# Altium schematic sheet [12] MISC.SchDoc: MISC
size A4; Engineer: M. Folejewski; DocumentNumber: 12; SheetNumber: 12; SheetTotal: 15; PageSize: A4; Designators: 800-899
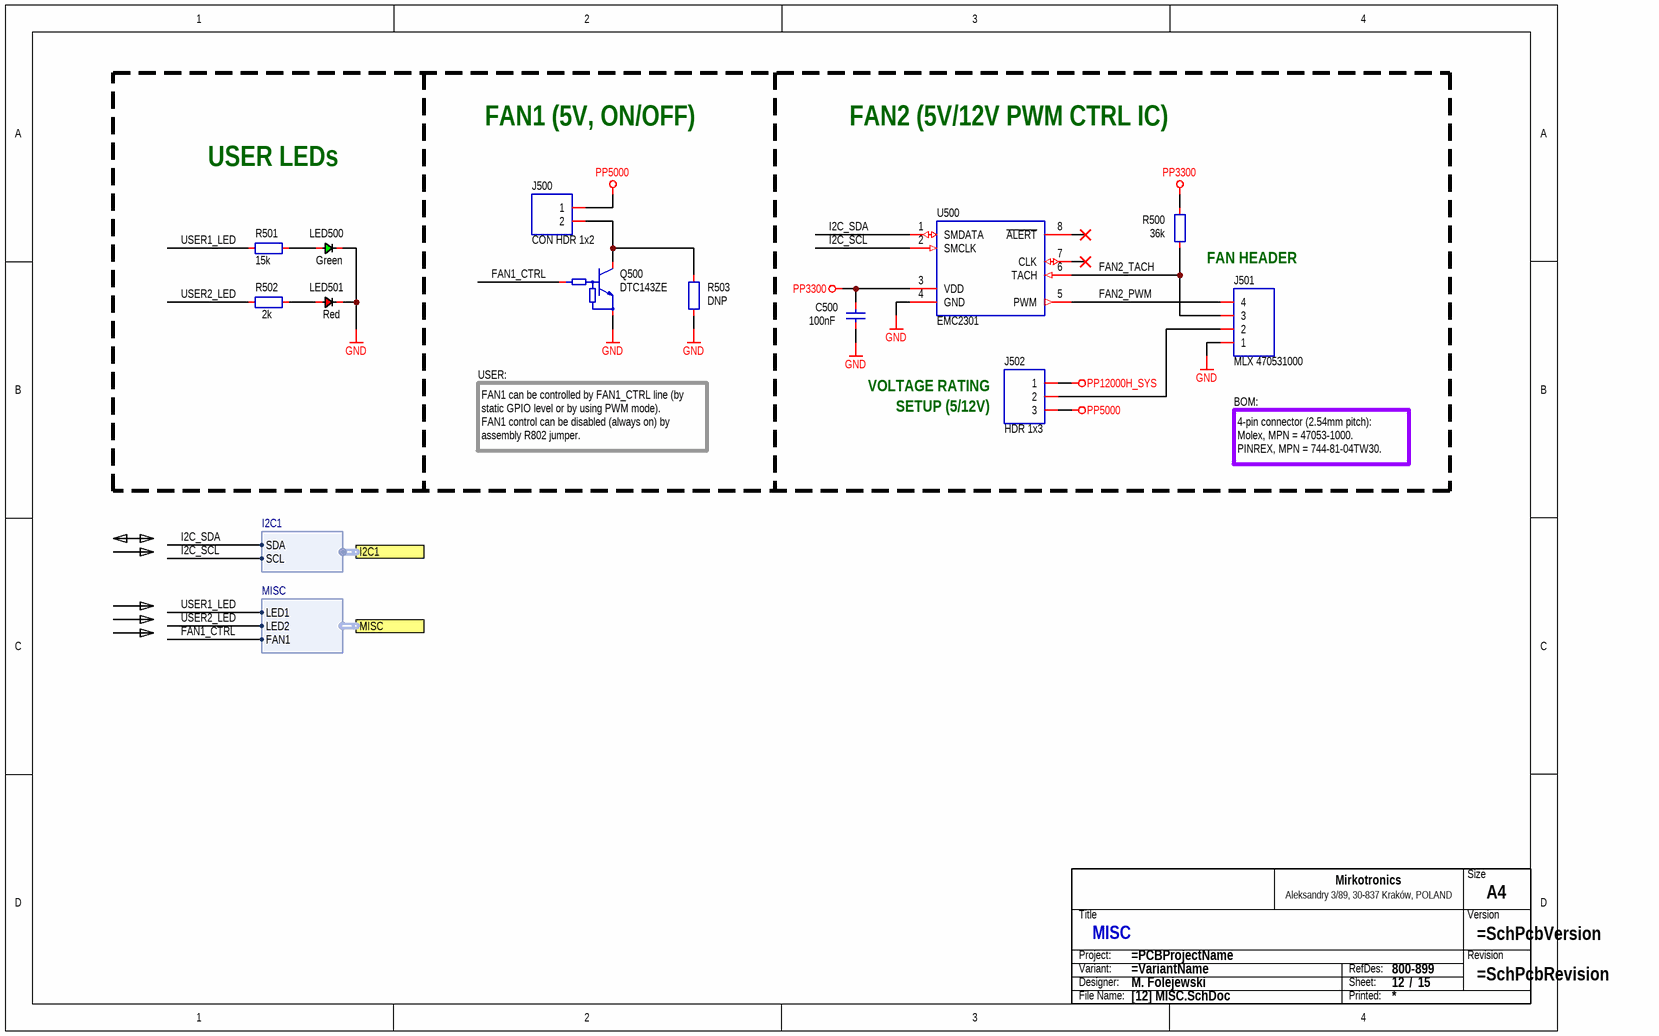
[diagram p0: [12] MISC.SchDoc]

## Parts
C500  100nF  [CAP_0603_R]
J500  CON HDR 1x2  [CON_HDR_P254_1X02_STR]
J501  MLX 470531000  [CON_MLX_470531000]
J502  HDR 1x3  [CON_HDR_P254_1X03_STR_JMP]
LED500  Green  [LED_0805_GRN_R]
LED501  Red  [LED_0805_RED_R]
Q500  DTC143ZE  [PKG_SOT523_SC75_SOT416_P100_R]
R500  36k  [RES_0603_R]
R501  15k  [RES_0603_R]
R502  2k  [RES_0603_R]
R503  DNP  [RES_0603_R]
TB?  Title block  (value not drawn)  (graphical)
U500  EMC2301  [ICC_TSSOP8_300X300X110P65]

## Ports
I2C1 (harness I2C1), MISC (harness MISC)

## Harnesses
MISC: LED1, LED2, FAN1
I2C1: SDA, SCL

## Nets
GND: C500.1 J501.1 LED500.1 LED501.1 Q500.2(E) R503.1 U500.4(GND)
PP3300: C500.2 R500.2 U500.3(VDD)
PP5000: J500.1 J502.3
PP12000H_SYS: J502.1
FAN1_CTRL: Q500.1(B) ; port MISC.FAN1
FAN2_PWM: J501.4 U500.5(PWM)
FAN2_TACH: J501.3 R500.1 U500.6(TACH)
I2C_SCL: U500.2(SMCLK) ; port I2C1.SCL
I2C_SDA: U500.1(SMDATA) ; port I2C1.SDA
USER1_LED: R501.1 ; port MISC.LED1
USER2_LED: R502.1 ; port MISC.LED2
NetJ500_2: J500.2 Q500.3(C) R503.2
NetJ501_2: J501.2 J502.2
NetLED500_2: LED500.2 R501.2
NetLED501_2: LED501.2 R502.2

Not connected (* = marked no-connect by the designer): U500 7(CLK)* 8(~{ALERT})*

## Notes on the sheet
- USER LEDs
- FAN1 (5V, ON/OFF)
- FAN2 (5V/12V PWM CTRL IC)
- FAN HEADER
- USER:
- FAN1 can be controlled by FAN1_CTRL line (by static GPIO level or by using PWM mode).
  FAN1 control can be disabled (always on) by assembly R802 jumper.
- VOLTAGE RATING
- SETUP (5/12V)
- BOM:
- 4-pin connector (2.54mm pitch):
  Molex, MPN = 47053-1000.
  PINREX, MPN = 744-81-04TW30.
- (in symbol SCH_TITLE_BLOCK_MIRKOTRONICS_V2) Size; Mirkotronics; Aleksandry 3/89, 30-837 Kraków, POLAND; Title; Version; Project:; Revision; Variant:; RefDes:; Designer:; Sheet:; /; File Name:; Printed:

## Library data of the parts
C500 = CAP-0008: Capacitor; MLCC; 100nF; TBD; TBD; TBD; TBD; SMD; 0603 (1608);; Component Type: Capacitor; Component Subtype: MLCC; Value: 100nF; Manufacturer: TBD; MPN: TBD; Mounting Type: SMD; Package (Case): 0603 (1608); Supplier: ?
J500 = CON-0020: Connector; Pin Header; 1 x 2 pins; 2.54mm; Male; TBD; TBD; THT; THT;; Manufacturer: GENERIC; Component Type: Connector; Component Subtype: Pin Header; Value: CON HDR 1x2; MPN: GENERIC; Mounting Type: THT; Package (Case): THT; Supplier: ?
J501 = CON_1X04_COL: Connector; 1 Row;; Manufacturer: Molex; Component Subtype: Pin header; Package (Case): THT; Component Type: Connector; Mounting Type: THT; MPN: 470531000; Value: MLX 470531000
J502 = CON_1X03_COL: Connector; 1 Row;; Manufacturer: GENERIC; Component Subtype: Pin Header; Package (Case): THT; Value: HDR 1x3; MPN: GENERIC; Component Type: Connector; Mounting Type: THT; Supplier: ?
LED500 = DIO_LED_GRN: Diode; LED; Green;; Manufacturer: Foshan NationStar Optoelectronics; MPN: NCD0805G1; Component Subtype: LED Diode; Package (Case): 0805 (2012); Value: Green; Component Type: LED; Mounting Type: SMD; Supplier: LCSC
LED501 = DIO_LED_RED: Diode; LED; Red;; Manufacturer: Foshan NationStar Optoelectronics; MPN: NCD0805R1; Component Subtype: LED Diode; Package (Case): 0805 (2012); Value: Red; Component Type: LED; Mounting Type: SMD; Supplier: LCSC
Q500 = TRA_BJT_NPN_DIG_BEC: Transistor; BJT; NPN; Digital;; Component Subtype: NPN Transistor; Value: DTC143ZE; MPN: DTC143ZE; Component Type: Transistor; Mounting Type: SMD; Supplier: ?
R500 R503 = RES-0054: Resistor; Thick Film; GENERIC; TBD; TBD; TBD; TBD; TBD; SMD; 0603 (1608);; Component Type: Resistor; Component Subtype: Thick Film; Manufacturer: GENERIC; MPN: GENERIC; Mounting Type: SMD; Package (Case): 0603 (1608); Supplier: ?
  R500: Value: 36k
  R503: Value: DNP
R501 = RES-0043: Resistor; Thick Film; 15k; 1%; 100mW; 100PPM; 75V; Standard; SMD; 0603 (1608);; Manufacturer: Yageo Corporation; MPN: TBD; Component Type: Resistor; Component Subtype: Thick Film; Value: 15k; Mounting Type: SMD; Package (Case): 0603 (1608); Supplier: ?
R502 = RES-0033: Resistor; Thick Film; 2k2; 1%; 100mW; 100PPM; 75V; Standard; SMD; 0603 (1608);; Manufacturer: Yageo Corporation; MPN: TBD; Component Type: Resistor; Component Subtype: Thick Film; Value: 2k; Mounting Type: SMD; Package (Case): 0603 (1608); Supplier: ?
TB? = SCH_TITLE_BLOCK_MIRKOTRONICS_V2: Component Type: Title block; Manufacturer: -; Mounting Type: Non component; MPN: -; Operating Temperature: -; Package: -; Specification: Title block; Value: Title block; Replacement: -; System: ?
U500 = ICC_MCP_EMC2301_MSOP-8: IC; Fan controller;; Manufacturer: Microchip Technology; MPN: EMC2301-1-ACZL-TR; Package (Case): MSOP-8; Component Subtype: Fan controller; Component Type: IC; Mounting Type: SMD; Value: EMC2301